# Altium schematic sheet Gate Drive Flyback.SchDoc
size 431 x 279 mm; SheetNumber: 4; SheetTotal: 4
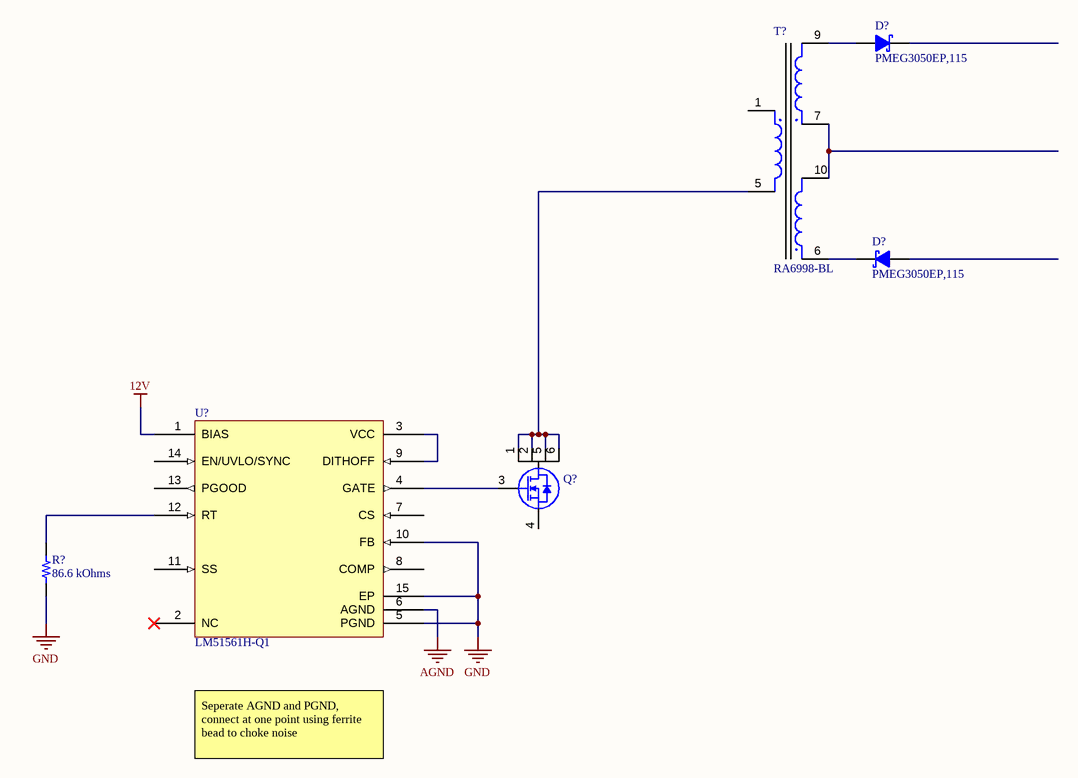
[diagram p0: Gate Drive Flyback.SchDoc]

## Parts
(Parts that share a designator on the sheet are numbered #1, #2 ... from top to bottom, then left to right.)
D?#1  PMEG3050EP,115
D?#2  PMEG3050EP,115
Q?  CSD19538Q2  (value not drawn)
R?  86.6 kOhms  [RES 0603_1608]
T?  RA6998-BL
U?  LM51561H-Q1

## Nets
12V: U?.1(BIAS)
AGND: U?.6(AGND)
GND: R?.1 U?.5(PGND) U?.10(FB) U?.15(EP)
NetD?#1_2: D?#1.2 T?.9
NetD?#2_1: D?#2.1 T?.6
NetQ?_1: Q?.1(DRAIN) Q?.2(DRAIN) Q?.5(DRAIN) Q?.6(DRAIN) T?.5
NetQ?_3: Q?.3(GATE) U?.4(GATE)
NetR?_2: R?.2 U?.12(RT)
NetT?_7: T?.7 T?.10
NetU?_3: U?.3(VCC) U?.9(DITHOFF)

Not connected (* = marked no-connect by the designer): D?#1 1; D?#2 2; Q? 4(SOURCE); T? 1; U? 2(NC)* 7(CS) 8(COMP) 11(SS) 13(PGOOD) 14(EN/UVLO/SYNC)

## Notes on the sheet
- Seperate AGND and PGND, connect at one point using ferrite bead to choke noise
- Title
- Project
- Scale
- Size
- B
- Part Number
- Engineer
- Sheet
- of
- Rev

## Library data of the parts
D?#1 D?#2 = PMEG3050EP,115: DIODE SCHOTTKY 30V 5A SOD128
Q? = CSD19538Q2: MOSFET N-CH 100V 14.4A 6WSON
R? = RMCF0603FT86K6: RES 86.6K OHM 1% 1/10W 0603; Manufacturer: Stackpole Electronics Inc; Power (Watts): 0.1W, 1/10W; Temperature Coefficient: ±100ppm/°C; Part Number: RMCF0603FT86K6; Value: 86.6 kOhms; ComponentLink1Description: Datasheet; ComponentLink1URL: https://www.seielect.com/catalog/sei-rmcf_rmcp.pdf; ComponentLink2Description: DigiKey Link; ComponentLink2URL: http://digikey.com/product-detail/en/stackpole-electronics-inc/RMCF0603FT86K6/RMCF0603FT86K6CT-ND/1943115; Composition: Thick Film; Device Package: 0603 (1608 Metric); Features: Automotive AEC-Q200; Height - Seated (Max): 0.022" (0.55mm); LastUpdated: 9/2/2020 1:10:13 AM; Lifecycle Status: Active; Minimum Order: 1; Number of Terminations: 2; Operating Temperature: -55°C ~ 155°C; Package / Case: 0603 (1608 Metric); Packaging: CutTape; PartId: 10849; Part Status: Active; Price: 0.10; Ratings: AEC-Q200; Resistance: 86.6 kOhms; Series: RMCF; Size / Dimension: 0.061" L x 0.031" W (1.55mm x 0.80mm); Supplier 1: DigiKey; Supplier Part Number 1: RMCF0603FT86K6CT-ND; Supplier Device Package: 0603; Tolerance: ±1%
T? = RA6998-BL: Forward Mode Planar Transformer
U? = LM51561H-Q1: 2.2-MHz Wide VIN 65-V Non-synchronous Boost/SEPIC/FlybackController with 150°C Maximum Junction Temperature